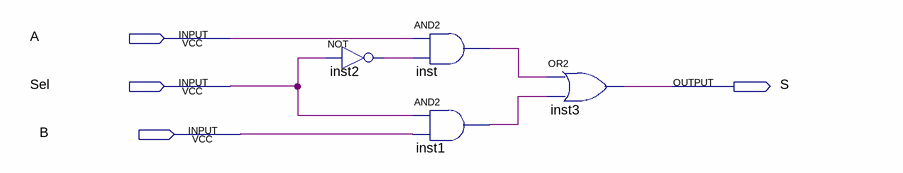
[diagram p0: schematic sheet]
// Quartus schematic Mux2to1.bdf as structural Verilog: 4 symbols, 4 pins
module Mux2to1 (
  input  A,
  input  Sel,
  input  B,
  output S
);

  wire inst1_out, inst2_out, inst_out;

  not inst2 (inst2_out, Sel);
  and inst (inst_out, A, inst2_out);
  and inst1 (inst1_out, Sel, B);
  or inst3 (S, inst_out, inst1_out);
endmodule
